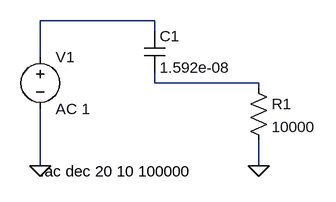
[diagram p0: schematic circuit.asc]
circuit.asc, the LTspice schematic file:
Version 4
SHEET 1 1760 880
SYMBOL voltage 128 136 R0
SYMATTR InstName V1
SYMATTR Value AC 1
SYMBOL cap 288 112 R0
SYMATTR InstName C1
SYMATTR Value 1.592e-08
SYMBOL res 448 184 R0
SYMATTR InstName R1
SYMATTR Value 10000
WIRE 128 96 304 96
WIRE 128 152 128 96
WIRE 128 232 128 320
WIRE 304 112 304 96
WIRE 304 176 304 192
WIRE 304 192 464 192
WIRE 464 200 464 192
WIRE 464 280 464 320
FLAG 128 320 0
FLAG 464 320 0
TEXT 128 328 Left 2 !.ac dec 20 10 100000

The netlist it stands for:
* circuit.asc
V1 N001 0 AC 1
C1 N001 N002 1.592e-08
R1 N002 0 10000
.ac dec 20 10 100000
.backanno
.end